# EAGLE design 17103448 (EAGLE 9.6.2)
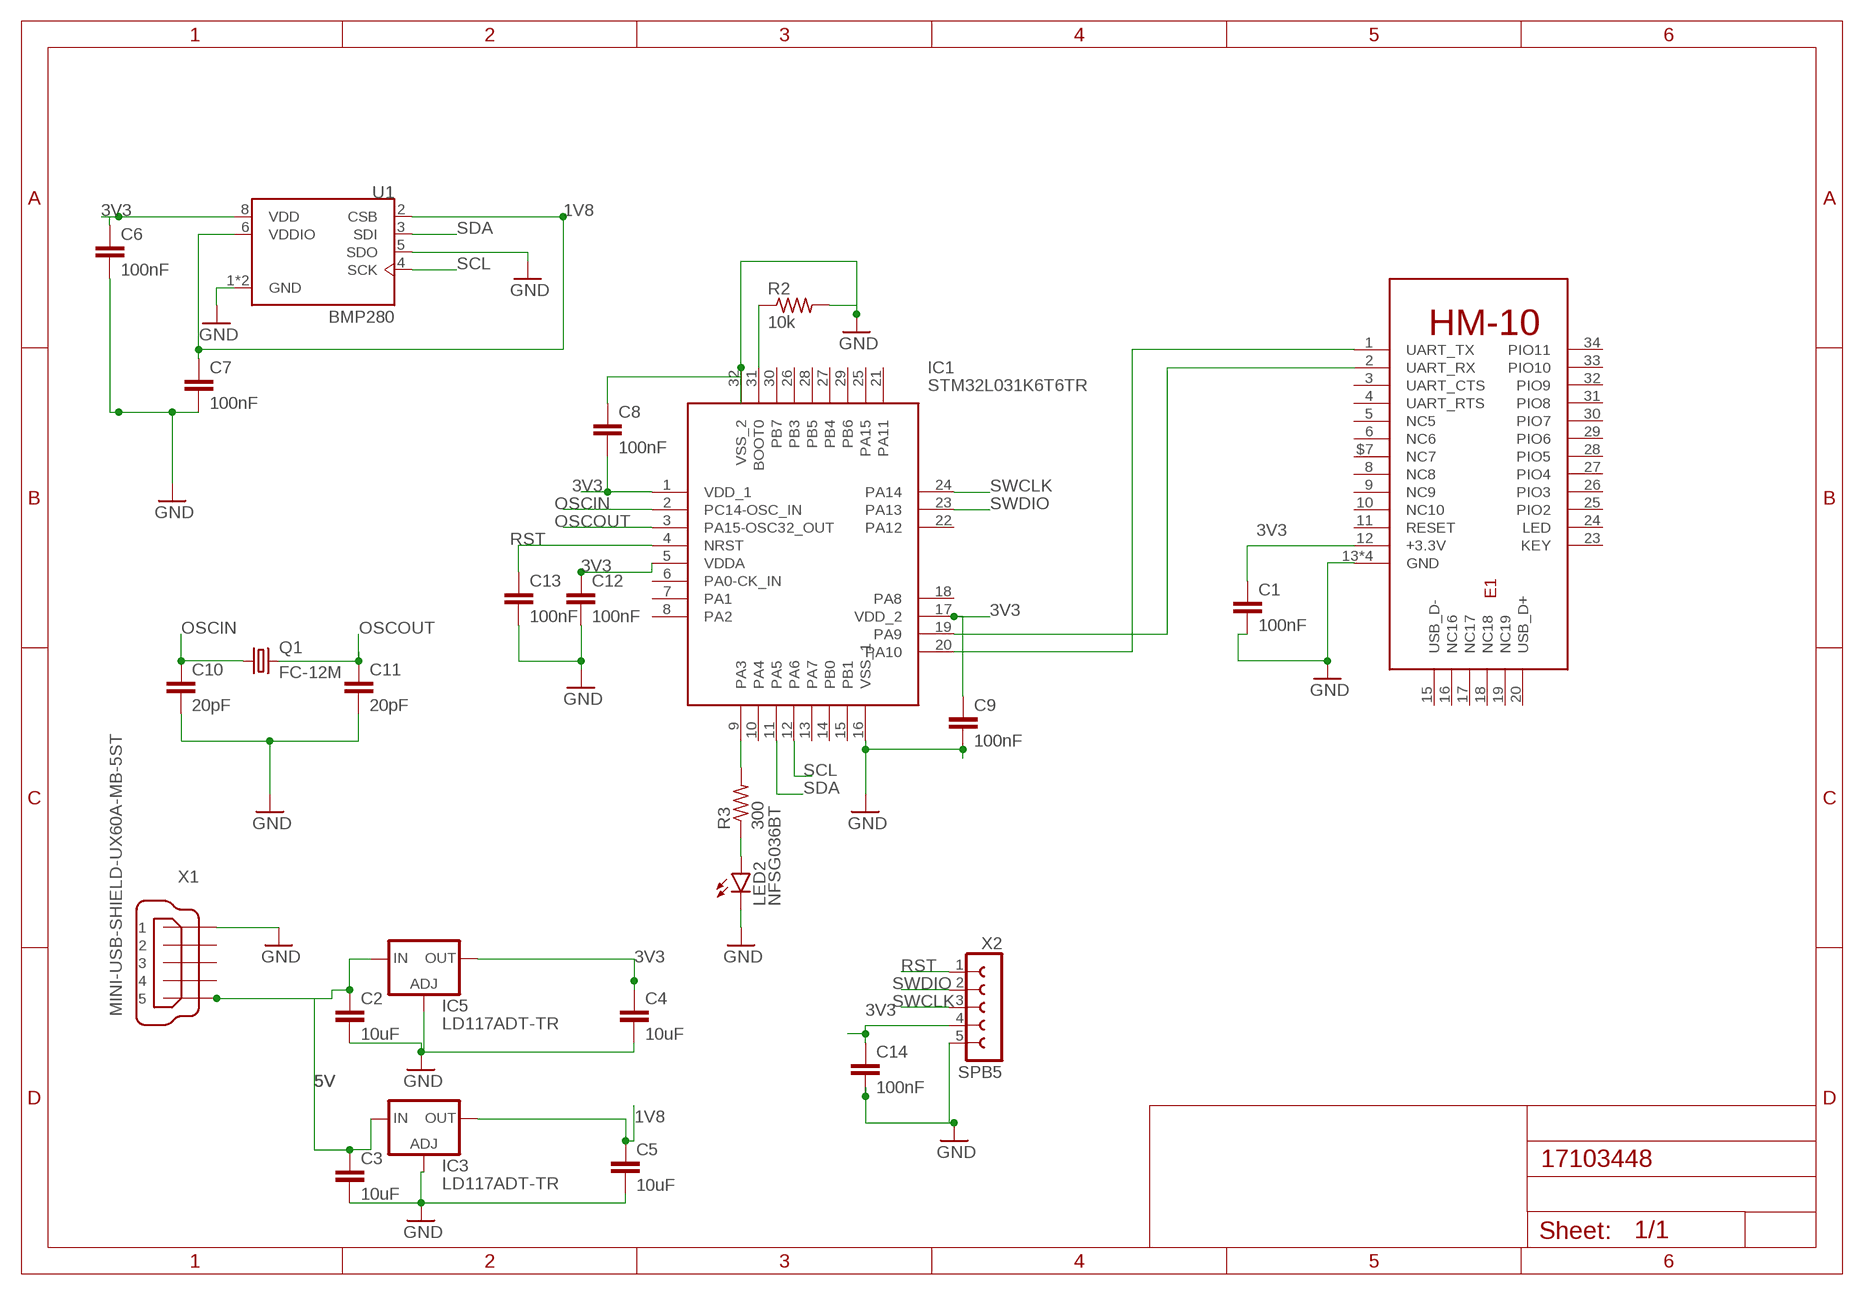
[diagram p0: schematic, sheet 1]

## Parts
C1  100nF  C-EUC0805  [C0805]
C2  10uF  C-EUC0805  [C0805]
C3  10uF  C-EUC0805  [C0805]
C4  10uF  C-EUC0805  [C0805]
C5  10uF  C-EUC0805  [C0805]
C6  100nF  C-EUC0805  [C0805]
C7  100nF  C-EUC0805  [C0805]
C8  100nF  C-EUC0805  [C0805]
C9  100nF  C-EUC0805  [C0805]
C10  20pF  C-EUC0805  [C0805]
C11  20pF  C-EUC0805  [C0805]
C12  100nF  C-EUC0805  [C0805]
C13  100nF  C-EUC0805  [C0805]
C14  100nF  C-EUC0805  [C0805]
E1  HM-10-BOARD  [26.9X13X2.2_BOARD]
IC1  STM32L031K6T6TR  [QFP80P900X900X160-32N]
IC3  LD117ADT-TR  [DPACK]
IC5  LD117ADT-TR  [DPACK]
LED2  NFSG036BT  [NFSG036BT]
Q1  FC-12M  [FC-12M]
R2  10k  R-US_R0805  [R0805]
R3  300  R-US_R0805  [R0805]
U1  BMP280  [XDCR_BMP280]
X1  MINI-USB-SHIELD-UX60A-MB-5ST  [UX60A-MB-5ST]
X2  SPB5  [SPB5]

## Nets
1V8: C5.1 C7.1 IC3.4(OUT) U1.2(CSB) U1.6(VDDIO)
3V3: C1.1 C4.1 C6.1 C8.2 C9.1 C12.1 C14.1 E1.12(+3.3V) IC1.1(VDD_1) IC1.5(VDDA) IC1.17(VDD_2) IC5.4(OUT) U1.8(VDD) X2.4
5V: C2.1 C3.1 IC3.3(IN) IC5.3(IN) X1.5
GND: C1.2 C2.2 C3.2 C4.2 C5.2 C6.2 C7.2 C8.1 C9.2 C10.2 C11.2 C12.2 C13.2 C14.2 E1.13(GND) E1.14(GND) E1.21(GND) E1.22(GND) IC1.16(VSS_1) IC1.32(VSS_2) IC3.1(ADJ) IC5.1(ADJ) LED2.C R2.2 U1.1(GND) U1.5(SDO) U1.7(GND) X1.1 X2.5
N$1: IC1.31(BOOT0) R2.1
N$2: E1.2(UART_RX) IC1.19(PA9)
N$3: E1.1(UART_TX) IC1.20(PA10)
N$4: LED2.A R3.1
N$5: IC1.9(PA3) R3.2
OSCIN: C10.1 IC1.2(PC14-OSC_IN) Q1.1
OSCOUT: C11.1 IC1.3(PA15-OSC32_OUT) Q1.2
RST: C13.1 IC1.4(NRST) X2.1
SCL: IC1.12(PA6) U1.4(SCK)
SDA: IC1.11(PA5) U1.3(SDI)
SWCLK: IC1.24(PA14) X2.3
SWDIO: IC1.23(PA13) X2.2
Unconnected: E1.3(UART_CTS) E1.4(UART_RTS) E1.5(NC5) E1.6(NC6) E1.8(NC8) E1.9(NC9) E1.10(NC10) E1.11(RESET) E1.15(USB_D-) E1.16(NC16) E1.17(NC17) E1.18(NC18) E1.19(NC19) E1.20(USB_D+) E1.23(KEY) E1.24(LED) E1.25(PIO2) E1.26(PIO3) E1.27(PIO4) E1.28(PIO5) E1.29(PIO6) E1.30(PIO7) E1.31(PIO8) E1.32(PIO9) E1.33(PIO10) E1.34(PIO11) E1.$7(NC7) IC1.6(PA0-CK_IN) IC1.7(PA1) IC1.8(PA2) IC1.10(PA4) IC1.13(PA7) IC1.14(PB0) IC1.15(PB1) IC1.18(PA8) IC1.21(PA11) IC1.22(PA12) IC1.25(PA15) IC1.26(PB3) IC1.27(PB4) IC1.28(PB5) IC1.29(PB6) IC1.30(PB7) X1.2 X1.3 X1.4 X1.M1(S1) X1.M2(S2) X1.M3(S3) X1.M4(S4)

## Library data of the parts
C1-C14 = rcl:C-EU: CAPACITOR, European symbol; SPICEPREFIX: C
E1 = hm10:HM-10: HM Bluetooth module use TI CC2540 or CC2541, Master and slave roles in one, transmission version and remote control version and PIO state acquisition functions in one, Support the AT command modify module parameters, Convenient and flexible.
IC1 = STM32L031K6T6TR:STM32L031K6T6TR: STMICROELECTRONICS - STM32L031K6T6TR - ARM MCU, STM32 Family STM32L0 Series Microcontrollers, ARM Cortex-M0+, 32bit, 32 MHz, 32 KB, 8 KB Source: Datasheet <https://4donline.ihs.com/images/VipMasterIC/IC/SGST/SGST-S-A0002219924/SGST-S-A0002219924-1.pdf?hkey=6D3A4C79FDBF58556ACFDE234799DDF0>; ARROW_PART_NUMBER: STM32L031K6T6TR; ARROW_PRICE-STOCK: https://www.arrow.com/en/products/stm32l031k6t6tr/stmicroelectronics; DESCRIPTION: STMICROELECTRONICS - STM32L031K6T6TR - ARM MCU, STM32 Family STM32L0 Series Microcontrollers, ARM Cortex-M0+, 32bit, 32 MHz, 32 KB, 8 KB; HEIGHT: 1.6mm; MANUFACTURER_NAME: STMicroelectronics; MANUFACTURER_PART_NUMBER: STM32L031K6T6TR; MOUSER_PART_NUMBER: 511-STM32L031K6T6TR; MOUSER_PRICE-STOCK: https://www.mouser.co.uk/ProductDetail/STMicroelectronics/STM32L031K6T6TR/?qs=xwQlLnDx56Cmxri8cgW0QQ%3D%3D
IC3 IC5 = v-reg:LD117A?*: Low drop fixed and adjustable positive voltage regulators 1 A Source: http://www.st.com/stonline/products/literature/ds/7194/ld1117axx.pdf
LED2 = led:NFSG036BT: CHIP TYPE GREEN LED NFSx036xT Source: NICHIA CORPORATION .. NFSG036BT-E.pdf
Q1 = crystal:FC-12M: kHz RANGE CRYSTAL UNIT LOW PROFILE SMD Source: Epson Toyocom FC-12M.pdf
R2 R3 = rcl:R-US_: RESISTOR, American symbol; SPICEPREFIX: R
U1 = BMP280:BMP280: BMP280 Absolute Barometric Pressure Sensor for Battery Powered Devices 2 x 2.5mm Check availability <https://pricing.snapeda.com/parts/BMP280/Bosch/view-part?ref=eda>; AVAILABILITY: In Stock; DESCRIPTION: Pressure Sensor 4.35PSI ~ 15.95PSI (30kPa ~ 110kPa) Absolute - 16b 8-SMD; MF: Bosch; MP: BMP280; PACKAGE: LGA-8 Bosch Tools; PRICE: None; PURCHASE-URL: https://pricing.snapeda.com/search/part/BMP280/?ref=eda
X1 = con-hirose:MINI-USB-SHIELD-: MINI USB Connector Source: http://www.hirose.co.jp/cataloge_hp/e24000019.pdf; OC_FARNELL: unknown; OC_NEWARK: unknown
X2 = con-hirschmann:SPB5: CONNECTOR 5 pins; OC_FARNELL: unknown; OC_NEWARK: unknown

## Board
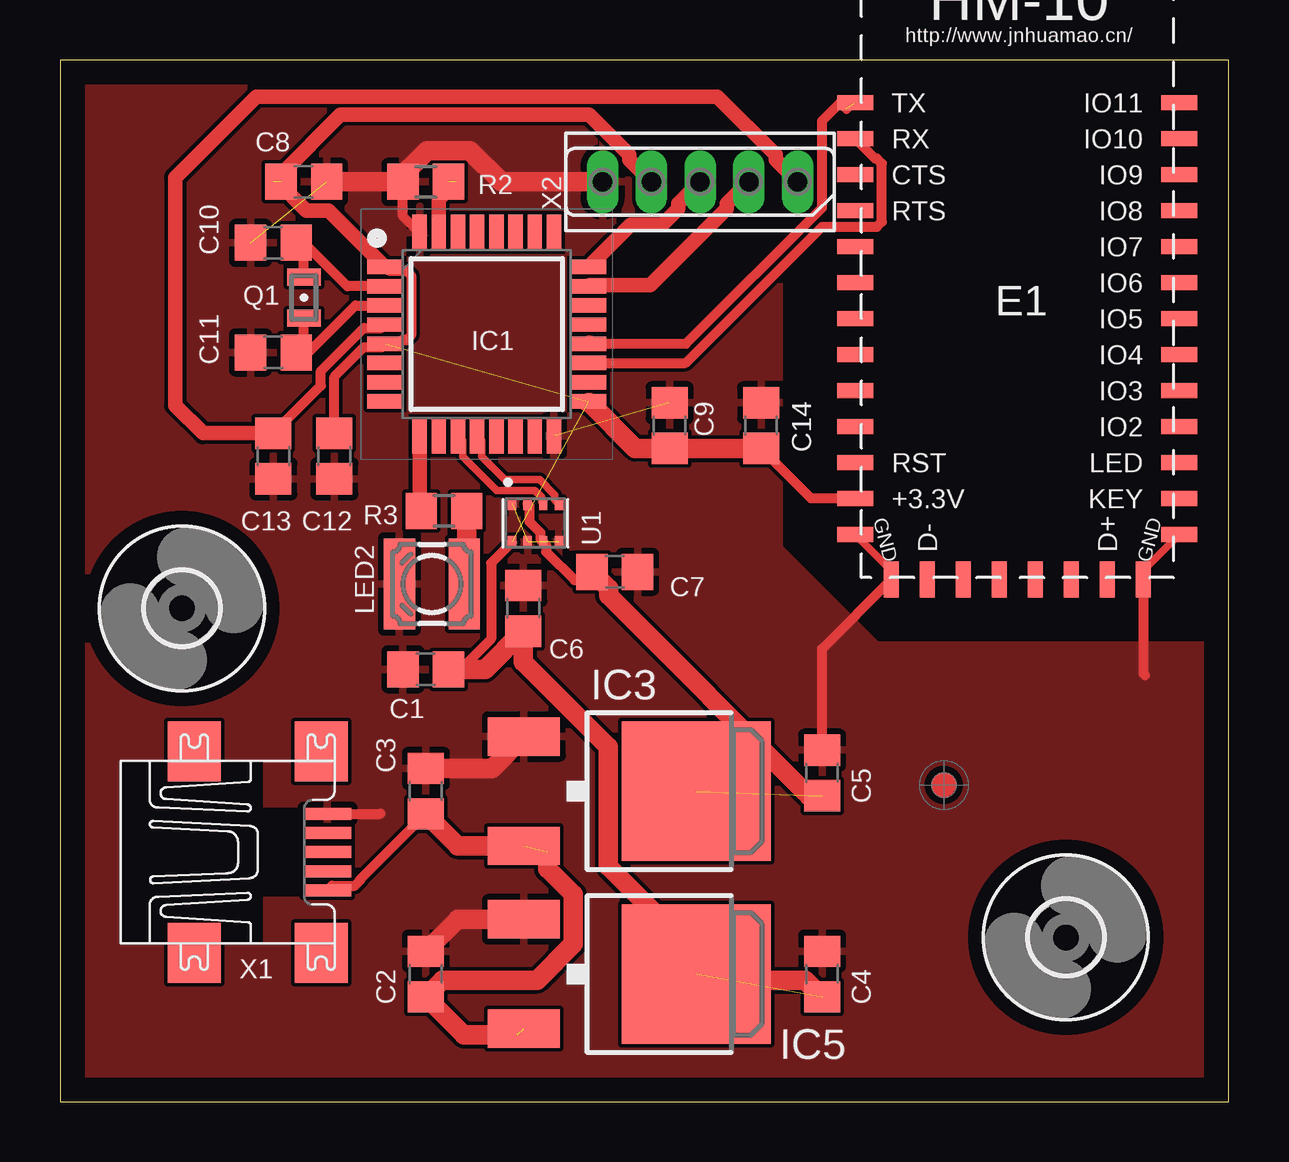
[diagram p1: board, top side]

Size 48.69 x 43.43 mm. Coordinates in mm from the lower left corner, seen from the top.
Outline: 0,0 48.69,0 48.69,43.42 0,43.43 0,0
Copper layers (1*16): Top 0.035mm / dielectric 1.5mm / Bottom 0.035mm
Design rules "default": minimum track width 6mil, minimum drill 0.35mm, track to track 6mil, track to pad 6mil, pad to pad 6mil, via to via 6mil, smd to smd 6mil, copper to edge 40mil, drill to drill 6mil, minimum pad ring 10mil, minimum via ring 8mil, stop-mask expansion 4mil, vias tented up to drill 0mil, thermal gap 10mil

### Footprints (pad centres in the part's own frame; a part is rotated, then mirrored left to right if it is on the bottom)
C0805 = smd 1.3 x 1.5: 1 -0.95,0; 2 0.95,0
26.9X13X2.2_BOARD = smd 1.5 x 0.635: 1 -7.5,0; 2 -7.5,-1.5; 3 -7.5,-3; 4 -7.5,-4.5; 5 -7.5,-6; 6 -7.5,-7.5; 8 -7.5,-10.5; 9 -7.5,-12; 10 -7.5,-13.5; 11 -7.5,-15; 12 -7.5,-16.5; 13 -7.5,-18; 22 6,-18; 23 6,-16.5; 24 6,-15; 25 6,-13.5; 26 6,-12; 27 6,-10.5; 28 6,-9; 29 6,-7.5; 30 6,-6; 31 6,-4.5; 32 6,-3; 33 6,-1.5; 34 6,0; $7 -7.5,-9 | smd 0.635 x 1.5: 14 -6,-19.875; 15 -4.5,-19.875; 16 -3,-19.875; 17 -1.5,-19.875; 18 0,-19.875; 19 1.5,-19.875; 20 3,-19.875; 21 4.5,-19.875
QFP80P900X900X160-32N = smd 1.475 x 0.6: 1 -4.238,2.8; 2 -4.238,2; 3 -4.238,1.2; 4 -4.238,0.4; 5 -4.238,-0.4; 6 -4.238,-1.2; 7 -4.238,-2; 8 -4.238,-2.8; 17 4.238,-2.8; 18 4.238,-2; 19 4.238,-1.2; 20 4.238,-0.4; 21 4.238,0.4; 22 4.238,1.2; 23 4.238,2; 24 4.238,2.8 | smd 0.6 x 1.475: 9 -2.8,-4.238; 10 -2,-4.238; 11 -1.2,-4.238; 12 -0.4,-4.238; 13 0.4,-4.238; 14 1.2,-4.238; 15 2,-4.238; 16 2.8,-4.238; 25 2.8,4.238; 26 2,4.238; 27 1.2,4.238; 28 0.4,4.238; 29 -0.4,4.238; 30 -1.2,4.238; 31 -2,4.238; 32 -2.8,4.238
DPACK = smd 1.6 x 3: 1 -2.28,-4.8; 3 2.28,-4.8 | smd 5.8 x 6.2: 4 0,2.38
NFSG036BT = smd 1.3 x 3.8: A 1.35,0; C -1.35,0
FC-12M = smd 0.7 x 1.4: 1 -0.85,0; 2 0.85,0
R0805 = smd 1.3 x 1.5: 1 -0.95,0; 2 0.95,0
XDCR_BMP280 = smd 0.5 x 0.35: 1 0.8,0.975; 2 0.8,0.325; 3 0.8,-0.325; 4 0.8,-0.975; 5 -0.8,-0.975; 6 -0.8,-0.325; 7 -0.8,0.325; 8 -0.8,0.975
3,0 = hole 3: 0,0
UX60A-MB-5ST = smd 2 x 0.5: 1 2.25,1.6; 2 2.25,0.8; 3 2.25,0; 4 2.25,-0.8; 5 2.25,-1.6 | smd 2.2 x 2.5: M1 -3.3,-4.2; M2 -3.3,4.2; M3 2,4.2; M4 2,-4.2
SPB5 = drill 0.813 long: 1 -4.064,0; 2 -2.032,0; 3 0,0; 4 2.032,0; 5 4.064,0

### Placement (x,y rotation side)
C1  15.24,18.03 180 top
C2  15.24,5.33 90 top
C3  15.24,12.95 90 top
C4  31.75,5.33 90 top
C5  31.75,13.72 90 top
C6  19.3,20.57 90 top
C7  23.11,22.1 0 top
C8  10.16,38.35 180 top
C9  29.21,28.19 90 top
C10  8.89,35.81 180 top
C11  8.89,31.24 180 top
C12  11.43,26.92 270 top
C13  8.89,26.92 270 top
C14  25.4,28.19 90 top
E1  40.64,41.66 0 top
IC1  17.78,32 0 top
IC3  24.13,12.95 270 top
IC5  24.13,5.33 270 top
LED2  15.49,21.59 0 top
Q1  10.16,33.53 270 top
R2  15.24,38.35 180 top
R3  16,24.64 180 top
U1  19.81,24.13 90 top
U$1  [FIDUCIAL_G10]  36.83,13.21 0 top
U$2  [3,0]  41.91,6.86 0 top
U$3  [3,0]  5.08,20.57 0 top
X1  8.89,10.41 0 top
X2  26.67,38.35 180 top

### Tracks (layer width: path | path; a pad name or v marks a point on that pad's centre or on a via)
1V8  (1 unrouted)
  Top 0.305: 20.17,23.36 U1.6
  Top 0.406: U1.2 19.56,24.86 19.56,24.19 20.02,23.73 20.02,23.45 U1.6 20.26,23.21 20.26,22.93 21.44,21.75 22.51,21.75
  Top 0.813: C7.1 22.51,21.75 22.86,21.41 22.86,21.12 31.21,12.77 C5.1
3V3  (6 unrouted)
  Top 0.406: E1.12 31.3,25.16 C9.1 | U1.8 17.97,22.46 17.97,19.3 16.7,18.03 C1.1 | IC1.1 13.69,34.66 14.43,34.66 14.63,34.45 14.63,31.96 14.43,31.75 14.22,31.75 13.97,31.5 | IC1.5 13.4,31.46 12.66,31.46 11.43,30.23 C12.1
  Top 0.61: IC1.1 11.2,37.15 10.27,37.15 9.06,38.35 8.89,38.35 | X2.4 23.72,39.27 23.72,39.48 22.05,41.15 11.68,41.15 9.21,38.67 C8.2
  Top 0.813: C6.1 19.3,18.35 22.85,14.8 22.85,9.82 27.6,5.08 31.06,5.08 C4.1 | C6.1 19.02,19.34 | 29.37,27.08 C9.1 C14.1 23.98,27.24 22.08,29.14 22.02,29.14 | C6.1 17.71,18.03 C1.1
5V  (2 unrouted)
  Top 0.406: X1.5 11.33,9.01 12.29,9.01 12.5,9.22 12.5,9.26 C3.1
  Top 0.813: 19.05,2.79 16.83,2.79 C2.1 15.93,5.08 19.88,5.08 21.39,6.58 21.39,8.65 20.32,9.71 20.32,10.41 | C3.1 16.57,10.67 IC3.3
GND  (4 unrouted)
  Top 0.305: E1.13 34.64,22.16 E1.14 | E1.21 45.14,22.16 E1.22
  Top 0.406: X1.1 13.35,12.01 | C5.2 31.75,18.89 E1.14 | IC1.32 14.29,36.93 R2.2 | E1.21 45.14,17.85 45.21,17.78
  Top 0.813: C2.2 16.57,7.61 IC5.1 | C3.2 18,13.9 IC3.1 | C8.1 14,38.35 15.31,39.66 17.07,39.66 18.38,38.35 X2.5
  pour Top: 0,43.18 29.72,43.18 29.97,43.43 29.97,23.11 34.04,19.05 48.51,19.05 48.51,0.25 48.26,0 0.76,0 -0.25,1.02 -0.25,42.93
N$1  (1 unrouted)
  Top 0.61: IC1.31 15.78,37.62 16.51,38.35
N$2
  Top 0.406: E1.2 33.97,39.33 34.04,39.33 34.25,39.12 34.25,36.69 34.04,36.48 31.75,36.48 26.07,30.8 IC1.19
N$3  (1 unrouted)
  Top 0.406: IC1.20 26.08,31.6 31.75,37.27 31.75,40.89 32.51,41.66 32.77,41.4
  Top 0.61: IC1.20 22.06,31.65
N$4
  Top 0.813: R3.1 16.95,21.7 LED2.A
N$5
  Top 0.61: R3.2 14.98,24.71 IC1.9
OSCIN
  Top 0.406: Q1.1 10.16,35.81 | 10.16,35.81 C10.1 | IC1.2 11.97,34 10.16,35.81
OSCOUT
  Top 0.406: IC1.3 12.31,33.2 10.35,31.24 C11.1 10.16,31.56 Q1.2
RST
  Top 0.406: 9.01,27.87 C13.1 10.87,29.85 10.87,30.47 12.66,32.26 13.4,32.26 IC1.4
  Top 0.61: X2.1 29.82,39.27 29.82,39.48 27.39,41.91 8.18,41.91 4.8,38.53 4.8,29.03 5.96,27.87 C13.1
SCL
  Top 0.305: U1.4 20.62,25.1 20.62,25.31 19.98,25.94 18.54,25.94 17.58,26.9 17.58,27.57 IC1.12
SDA
  Top 0.305: IC1.11 16.78,27.57 16.78,26.9 18.19,25.48 19.79,25.48 20.07,25.21 20.07,25 U1.3
SWCLK
  Top 0.61: IC1.24 23.79,36.58 25.1,36.58 25.76,37.23 25.76,37.44 X2.3
SWDIO
  Top 0.61: IC1.23 22.06,34.04 24.6,34.04 27.79,37.23 27.79,37.44 X2.2